# Altium schematic sheet RF.SchDoc: Kite Up
size A; Author: PIF.HW Team; CompanyName: Pay It Forward club; DrawnBy: PIF.HW Team; Organization: Pay It Forward club; Address1: 304B1, HCMC; Address2: 268 Ly Thuong Kiet street; Address3: Ward 14, District 10; Address4: Ho Chi Minh city, Vietnam; Revision: v1.3; SheetNumber: 2; SheetTotal: 2; ProjectTitle: Kite Up; DocumentName: Kite Up RC; ProjectName: Kite Up
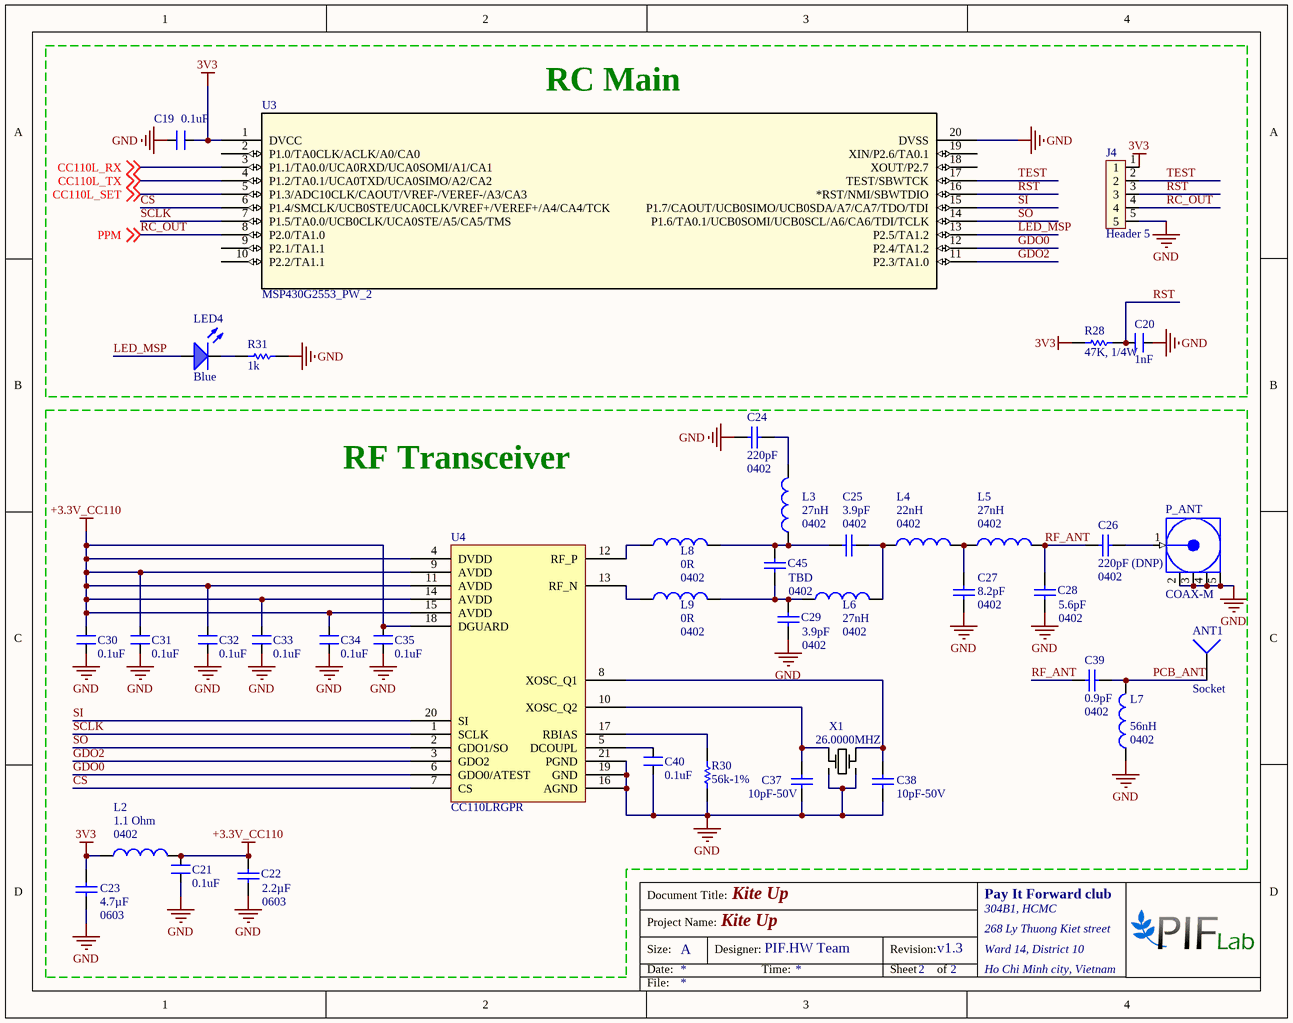
[diagram p0: RF.SchDoc]

## Parts
ANT1  Socket  [433_Antenna]
C19  0.1uF  [CAP 0603(1508)]
C20  1nF  [CAP 0603(1508)]
C21  0.1uF  [CAP 0603(1508)]
C22  Capacitance: 2.2µF  Package / Case: 0603  [CAP 0603(1508)]  (hidden comment: 2.2UF 10V X5R 0603)
C23  Capacitance: 4.7µF  Package / Case: 0603  [CAP 0603(1508)]  (hidden comment: 4.7UF 10V X5R 0603)
C24  Capacitance: 220pF  Package / Case: 0402  [C0402_TYPE2]
C25  Capacitance: 3.9pF  Package / Case: 0402  [C0402_TYPE2]
C26  Capacitance: 220pF (DNP)  Package / Case: 0402  [C0402_TYPE2]
C27  Capacitance: 8.2pF  Package / Case: 0402  [C0402_TYPE2]
C28  Capacitance: 5.6pF  Package / Case: 0402  [C0402_TYPE2]
C29  Capacitance: 3.9pF  Package / Case: 0402  [C0402_TYPE2]
C30  0.1uF  [CAP 0603(1508)]
C31  0.1uF  [CAP 0603(1508)]
C32  0.1uF  [CAP 0603(1508)]
C33  0.1uF  [CAP 0603(1508)]
C34  0.1uF  [CAP 0603(1508)]
C35  0.1uF  [CAP 0603(1508)]
C37  10pF-50V  [C0402_TYPE2]
C38  10pF-50V  [C0402_TYPE2]
C39  Capacitance: 0.9pF  Package / Case: 0402  [C0402_TYPE2]
C40  0.1uF  [CAP 0603(1508)]
C45  Capacitance: TBD  Package / Case: 0402  [C0402_TYPE2]  (no BOM)
J4  Header 5  [Header 5]
L2  DC Resistance (DCR) (Max): 1.1 Ohm  Package / Case: 0402  [L0402_TYPE2]
L3  Inductance: 27nH  Package / Case: 0402  [L0402_TYPE2]
L4  Inductance: 22nH  Package / Case: 0402  [L0402_TYPE2]
L5  Inductance: 27nH  Package / Case: 0402  [L0402_TYPE2]
L6  Inductance: 27nH  Package / Case: 0402  [L0402_TYPE2]
L7  Inductance: 56nH  Package / Case: 0402  [L0402_TYPE2]
L8  Inductance: 0R  Package / Case: 0402  [L0402_TYPE2]
L9  Inductance: 0R  Package / Case: 0402  [L0402_TYPE2]
LED4  value Blue  [LED0805BLUE]  (hidden comment: LED_BLUE)
P_ANT  COAX-M  [MMCX2.54-V5]
R28  47K, 1/4W  [RES 0603(1508)]
R30  56k-1%  [R0402_TYPE2]
R31  1k  [RES 0603(1508)]
U3  MSP430G2553_PW_2  [PW20]
U4  CC110LRGPR  [VQFN20]
X1  26.0000MHZ  [Crystal-3.2x2.5]

## Blocks framed on the sheet
RC Main: C19 C20 J4 LED4 R28 R31 U3
RF Transceiver: ANT1 C21-C35 C37-C40 C45 L2-L9 P_ANT R30 U4 X1

## Nets
3V3: C19.1 C23.2 J4.1 L2.2 R28.1 U3.1(DVCC)
+3.3V_CC110: C21.2 C22.2 C30.2 C31.2 C32.2 C33.2 C34.2 C35.2 L2.1 U4.4(DVDD) U4.9(AVDD) U4.11(AVDD) U4.14(AVDD) U4.15(AVDD) U4.18(DGUARD)
GND: C19.2 C20.2 C21.1 C22.1 C23.1 C24.1 C27.1 C28.1 C29.2 C30.1 C31.1 C32.1 C33.1 C34.1 C35.1 C37.1 C38.1 C40.1 J4.5 L7.2 P_ANT.2(GND) P_ANT.3(GND) P_ANT.4(GND) P_ANT.5(GND) R30.1 R31.1 U3.20(DVSS) U4.16(AGND) U4.19(GND) U4.21(PGND) X1.2(GND) X1.4(GND)
CC110L_RX: U3.3(P1.1/TA0.0/UCA0RXD/UCA0SOMI/A1/CA1) ; off-sheet CC110L_RX
CC110L_SET: U3.5(P1.3/ADC10CLK/CAOUT/VREF-/VEREF-/A3/CA3) ; off-sheet CC110L_SET
CC110L_TX: U3.4(P1.2/TA0.1/UCA0TXD/UCA0SIMO/A2/CA2) ; off-sheet CC110L_TX
CS: U3.6(P1.4/SMCLK/UCB0STE/UCA0CLK/VREF+/VEREF+/A4/CA4/TCK) U4.7(CS)
GDO0: U3.12(P2.4/TA1.2) U4.6(GDO0/ATEST)
GDO2: U3.11(P2.3/TA1.0) U4.3(GDO2)
LED_MSP: LED4.1(A) U3.13(P2.5/TA1.2)
PCB_ANT: ANT1.1 C39.2 L7.1
RC_OUT: J4.4 U3.8(P2.0/TA1.0) ; off-sheet PPM  [also labelled PPM]
RF_ANT: C26.1 C28.2 C39.1 L5.1
RST: C20.1 J4.3 R28.2 U3.16(*RST/NMI/SBWTDIO)
SCLK: U3.7(P1.5/TA0.0/UCB0CLK/UCA0STE/A5/CA5/TMS) U4.1(SCLK)
SI: U3.15(P1.7/CAOUT/UCB0SIMO/UCB0SDA/A7/CA7/TDO/TDI) U4.20(SI)
SO: U3.14(P1.6/TA0.1/UCB0SOMI/UCB0SCL/A6/CA6/TDI/TCLK) U4.2(GDO1/SO)
TEST: J4.2 U3.17(TEST/SBWTCK)
NetC24_2: C24.2 L3.1
NetC25_1: C25.1 C45.1 L3.2 L8.1
NetC25_2: C25.2 L4.2 L6.1
NetC26_2: C26.2 P_ANT.1(Signal)
NetC27_2: C27.2 L4.1 L5.2
NetC29_1: C29.1 C45.2 L6.2 L9.1
NetC37_2: C37.2 U4.10(XOSC_Q2) X1.1(HOT)
NetC38_2: C38.2 U4.8(XOSC_Q1) X1.3(HOT)
NetC40_2: C40.2 U4.5(DCOUPL)
NetL8_2: L8.2 U4.12(RF_P)
NetL9_2: L9.2 U4.13(RF_N)
NetLED4_2: LED4.2(K) R31.2
NetR30_2: R30.2 U4.17(RBIAS)

Not connected (* = marked no-connect by the designer): U3 2(P1.0/TA0CLK/ACLK/A0/CA0) 9(P2.1/TA1.1) 10(P2.2/TA1.1) 18(XOUT/P2.7) 19(XIN/P2.6/TA0.1)

## Notes on the sheet
- Document Title:
- Size:
- Date:
- Project Name:
- A
- Designer:
- Time:
- Revision:
- Sheet
- of
- File:

## Library data of the parts
C19-C21 C30-C35 C40 = CAP_NONPOL: Ceramic capacitor
C22 = 100nF-16V-C0402: CAP CER 2.2UF 10V X5R 0603; Manufacturer: Yageo; Manufacturer Part Number: CC0603KRX5R6BB225; Tolerance: ±10%; Supplier 1: Digi-Key; Supplier Part Number 1: 311-1451-2-ND; RoHS: RoHS Compliant; Category: Capacitors; Stock 1: 360000; Pricing 1: 4000=0.01939, 8000=0.01804, 12000=0.01714, 28000=0.01624, 100000=0.01229 (USD); Packaging: Tape & Reel (TR); Voltage - Rated: 10V; Temperature Coefficient: X5R; Mounting Type: Surface Mount, MLCC; Operating Temperature: -55°C ~ 85°C; Applications: General Purpose; Ratings: -; Size / Dimension: 0.063" L x 0.031" W (1.60mm x 0.80mm); Height - Seated (Max): -; Thickness (Max): 0.035" (0.90mm); Lead Spacing: -; Features: -; Lead Style: -; ComponentLink1URL: http://www.yageo.com/documents/recent/UPY-GPHC_X5R_4V-to-50V-21.pdf; ComponentLink1Description: http://www.yageo.com/documents/recent/UPY-GPHC_X5R_4V-to-50V-21.pdf
C23 = 10pF-50V-C0402-5%: CAP CER 4.7UF 10V X5R 0603; Manufacturer: Yageo; Manufacturer Part Number: CC0603KRX5R6BB475; Tolerance: ±10%; Supplier 1: Digi-Key; Supplier Part Number 1: 311-1455-1-ND; RoHS: RoHS Compliant; Category: Capacitors; Stock 1: 521169; Pricing 1: 1=0.15, 10=0.1, 25=0.0752, 100=0.0476, 250=0.04008, 500=0.03356, 1000=0.02755 (USD); Packaging: Cut Tape (CT); Voltage - Rated: 10V; Temperature Coefficient: X5R; Mounting Type: Surface Mount, MLCC; Operating Temperature: -55°C ~ 85°C; Applications: General Purpose; Ratings: -; Size / Dimension: 0.063" L x 0.031" W (1.60mm x 0.80mm); Height - Seated (Max): -; Thickness (Max): 0.035" (0.90mm); Lead Spacing: -; Features: -; Lead Style: -; ComponentLink1URL: http://www.yageo.com/documents/recent/UPY-GPHC_X5R_4V-to-50V-21.pdf; ComponentLink1Description: http://www.yageo.com/documents/recent/UPY-GPHC_X5R_4V-to-50V-21.pdf
C24 C26 C39 = 3.3pF-50V-C0402-0.25pF: CAP CER 3.9PF 50V NP0 0402; Manufacturer: Murata Electronics North America; Manufacturer Part Number: GRM1555C1H221JA01D; Tolerance: ±5%; Temperature Coefficient: C0G, NP0; Supplier 1: Digi-Key; Supplier Part Number 1: 490-1293-2-ND; RoHS: RoHS Compliant; Category: Capacitors; Stock 1: 470000; Pricing 1: 10000=0.00336, 20000=0.0032, 30000=0.00304, 50000=0.00272, 100000=0.0022 (USD); Packaging: Tape & Reel (TR); Voltage - Rated: 50V; Mounting Type: Surface Mount, MLCC; Operating Temperature: -55°C ~ 125°C; Applications: General Purpose; Ratings: -; Size / Dimension: 0.039" L x 0.020" W (1.00mm x 0.50mm); Height - Seated (Max): -; Thickness (Max): 0.022" (0.55mm); Lead Spacing: -; Features: -; Lead Style: -; ComponentLink1URL: http://www.murata.com/~/media/webrenewal/support/library/catalog/products/capacitor/mlcc/c02e.pdf; ComponentLink1Description: http://www.murata.com/~/media/webrenewal/support/library/catalog/products/capacitor/mlcc/c02e.pdf
C25 C29 C45 = 3.3pF-50V-C0402-0.25pF: CAP CER 3.9PF 50V NP0 0402; Manufacturer: Murata Electronics North America; Manufacturer Part Number: GRM1555C1H3R9CZ01D; Tolerance: ±0.25pF; Temperature Coefficient: C0G, NP0; Supplier 1: Digi-Key; Supplier Part Number 1: 490-1272-2-ND; RoHS: RoHS Compliant; Category: Capacitors; Stock 1: 0; Pricing 1: 10000=0 (USD); Packaging: Tape & Reel (TR); Voltage - Rated: 50V; Mounting Type: Surface Mount, MLCC; Operating Temperature: -55°C ~ 125°C; Applications: General Purpose; Ratings: -; Size / Dimension: 0.039" L x 0.020" W (1.00mm x 0.50mm); Height - Seated (Max): -; Thickness (Max): 0.022" (0.55mm); Lead Spacing: -; Features: -; Lead Style: -; ComponentLink1URL: http://media.digikey.com/pdf/Data%20Sheets/Murata%20PDFs/Chip%20Monolithic%20Ceramic%20Caps.pdf; ComponentLink1Description: http://media.digikey.com/pdf/Data%20Sheets/Murata%20PDFs/Chip%20Monolithic%20Ceramic%20Caps.pdf
C27 = 8.2pF-50V-C0402-0.5pF: GRM1555C1H8R2CZ01D; Manufacturer: Murata Electronics North America; Tolerance: ±0.25pF; Voltage - Rated: 50V; Temperature Coefficient: C0G, NP0; Supplier 1: Digi-Key; Supplier Part Number 1: GRM1555C1H8R2CZ01D-ND; Manufacturer Part Number: GRM1555C1H8R2CZ01D; RoHS: RoHS Compliant; Category: Capacitors; Stock 1: 0; Pricing 1: 60000=0 (USD); Packaging: Tape & Reel (TR); Mounting Type: Surface Mount, MLCC; Operating Temperature: -55°C ~ 125°C; Applications: General Purpose; Ratings: -; Size / Dimension: 0.039" L x 0.020" W (1.00mm x 0.50mm); Height - Seated (Max): -; Thickness (Max): 0.022" (0.55mm); Lead Spacing: -; Features: -; Lead Style: -; ComponentLink1URL: http://media.digikey.com/pdf/Data%20Sheets/Murata%20PDFs/Chip%20Monolithic%20Ceramic%20Caps.pdf; ComponentLink1Description: http://media.digikey.com/pdf/Data%20Sheets/Murata%20PDFs/Chip%20Monolithic%20Ceramic%20Caps.pdf
C28 = 5.6pF-50V-C0402-0.5pF: CAP CER 5.6PF 50V NP0 0402; Manufacturer: Murata Electronics North America; Manufacturer Part Number: GRM1555C1H5R6CZ01D; Tolerance: ±0.25pF; Temperature Coefficient: C0G, NP0; Supplier 1: Digi-Key; Supplier Part Number 1: GRM1555C1H5R6CZ01D-ND; RoHS: RoHS Compliant; Category: Capacitors; Stock 1: 0; Pricing 1: 60000=0 (USD); Packaging: Tape & Reel (TR); Voltage - Rated: 50V; Mounting Type: Surface Mount, MLCC; Operating Temperature: -55°C ~ 125°C; Applications: General Purpose; Ratings: -; Size / Dimension: 0.039" L x 0.020" W (1.00mm x 0.50mm); Height - Seated (Max): -; Thickness (Max): 0.022" (0.55mm); Lead Spacing: -; Features: -; Lead Style: -; ComponentLink1URL: http://media.digikey.com/pdf/Data%20Sheets/Murata%20PDFs/Chip%20Monolithic%20Ceramic%20Caps.pdf; ComponentLink1Description: http://media.digikey.com/pdf/Data%20Sheets/Murata%20PDFs/Chip%20Monolithic%20Ceramic%20Caps.pdf
C37 C38 = 10pF-50V-C0402-5%: CAP CER 10PF 50V NPO 0402; Manufacturer: Yageo; Manufacturer Part Number: CC0402JRNPO9BN100; Digi-Key Part Number: 311-1014-1-ND; Unit Price: 0.00312
L2 = 8.2nH-500mA-0402: FERRITE BEAD 1 KOHM 0402 1LN; Manufacturer: Murata Electronics North America; Manufacturer Part Number: BLM15HG102SN1D; Filter Type: Signal Line; Number of Lines: 1; Impedance @ Frequency: 1 kOhm @ 100MHz; Current Rating (Max): 250mA; Supplier 1: Digi-Key; Supplier Part Number 1: 490-3999-2-ND; RoHS: RoHS Compliant; Category: Filters; Stock 1: 230000; Pricing 1: 10000=0.0509, 20000=0.04844, 30000=0.04713 (USD); Packaging: Tape & Reel (TR); Ratings: -; Operating Temperature: -55°C ~ 125°C; Mounting Type: Surface Mount; Height (Max): 0.022" (0.55mm); Size / Dimension: 0.039" L x 0.020" W (1.00mm x 0.50mm); ComponentLink1URL: http://search.murata.co.jp/Ceramy/image/img/PDF/ENG/L0110S0101BLM15H.pdf; ComponentLink1Description: http://search.murata.co.jp/Ceramy/image/img/PDF/ENG/L0110S0101BLM15H.pdf
L3 L5-L9 = 8.2nH-500mA-0402: FIXED IND 27NH 300MA 460 MOHM; Manufacturer: Murata Electronics North America; Manufacturer Part Number: LQG15HS27NJ02D; Type: Multilayer; Material - Core: Air; Tolerance: ±5%; Shielding: Unshielded; DC Resistance (DCR): 460 mOhm Max; Q @ Freq: 8 @ 100MHz; Frequency - Self Resonant: 1.7GHz; Frequency - Test: 100MHz; Supplier 1: Digi-Key; Supplier Part Number 1: 490-2628-2-ND; RoHS: RoHS Compliant; Category: Inductors, Coils, Chokes; Stock 1: 120000; Pricing 1: 10000=0.01872, 30000=0.01814, 50000=0.01755, 100000=0.01697 (USD); Packaging: Tape & Reel (TR); Current Rating: 300mA; Current - Saturation: -; Ratings: -; Operating Temperature: -55°C ~ 125°C; Mounting Type: Surface Mount; Size / Dimension: 0.039" L x 0.020" W (1.00mm x 0.50mm); Height - Seated (Max): 0.022" (0.55mm); ComponentLink1URL: http://search.murata.co.jp/Ceramy/image/img/PDF/ENG/L0075S0083LQG15HS.pdf; ComponentLink1Description: http://search.murata.co.jp/Ceramy/image/img/PDF/ENG/L0075S0083LQG15HS.pdf
L4 = 8.2nH-500mA-0402: FIXED IND 22NH 300MA 420 MOHM; Manufacturer: Murata Electronics North America; Manufacturer Part Number: LQG15HS22NJ02D; Type: Multilayer; Material - Core: Air; Tolerance: ±5%; Shielding: Unshielded; DC Resistance (DCR): 420 mOhm Max; Q @ Freq: 8 @ 100MHz; Frequency - Self Resonant: 1.9GHz; Frequency - Test: 100MHz; Supplier 1: Digi-Key; Supplier Part Number 1: 490-2627-1-ND; RoHS: RoHS Compliant; Category: Inductors, Coils, Chokes; Stock 1: 250711; Pricing 1: 1=0.1, 10=0.059, 25=0.0528, 50=0.0456, 100=0.041, 250=0.03804, 500=0.0351, 750=0.03335, 1000=0.03042 (USD); Packaging: Cut Tape (CT); Current Rating: 300mA; Current - Saturation: -; Ratings: -; Operating Temperature: -55°C ~ 125°C; Mounting Type: Surface Mount; Size / Dimension: 0.039" L x 0.020" W (1.00mm x 0.50mm); Height - Seated (Max): 0.022" (0.55mm); ComponentLink1URL: http://search.murata.co.jp/Ceramy/image/img/PDF/ENG/L0075S0083LQG15HS.pdf; ComponentLink1Description: http://search.murata.co.jp/Ceramy/image/img/PDF/ENG/L0075S0083LQG15HS.pdf
LED4 = LED_BLUE: LED Blue; ComponentLink1Description: Datasheet; ComponentLink1URL: D:\Dropbox\Datasheets\Opto and Illumination\LEDs\SMD LED.pdf; Unit Price: 0.0476
P_ANT = COAX-M: RF Coaxial PCB Connector, MMCX; Thru-Hole, Vertical Mount Plug,  50 Ohm Impedance; PackageDocument: Rev. A, 16-Jun-1997; PCB_Layout: Complies with manufacturer's recommendation.; DrillSize: Corresponds to nominal value.; Published: 15-Jul-2004; LatestRevisionDate: 15-Jul-2004; LatestRevisionNote: Component Replaced.; DatasheetDocument: 30-May-2003; PackageReference: 908-21103; Publisher: Altium Limited; ComponentLink1Description: Manufacturer Link; ComponentLink1URL: http://www.amphenolrf.com/
R28 R31 = Res 1/4W: Resistor through hole 1/4W
R30 = 56k-1%-R0402: RES 56.0K OHM 1/16W 1% 0402 SMD; Manufacturer: Yageo; Manufacturer Part Number: RC0402FR-0756KL; Digi-Key Part Number: 311-56.0KLRTR-ND; Unit Price: 0.00149
U3 = MSP430G2553_PW_2: Imported; Manufacturer_Part_Number: msp430g2553_pw_20; Vendor: Texas Instruments; PACKAGE_DESIGNATOR: PW; PIN_COUNT: 20; FAMILY_NAME: Value Line; INDUSTRY_STD_PKG_TYPE: TSSOP; GENERIC_PART_NUMBER: MSP430G2553; Manufacturer: Texas Instruments; Datasheet_URL: http://www.ti.com/lit/gpn/MSP430G2553; Value: Value; Type: Type; RefDes: RefDes
U4 = CC110LRGPR: IC RF TXRX ISM<1GHZ 20-VFQFN; Manufacturer: Texas Instruments; RF Family/Standard: General ISM < 1GHz; Modulation: 2FSK, 4FSK, GFSK, MSK, OOK; Frequency: 300MHz ~ 348MHz, 387MHz ~ 464MHz, 779MHz ~ 928MHz; Data Rate (Max): 600kbps; Power - Output: 12dBm; Sensitivity: -116dBm; Serial Interfaces: SPI; Voltage - Supply: 1.8 V ~ 3.6 V; Current - Receiving: 14.3mA ~ 17.1mA; Current - Transmitting: 12.3mA ~ 34.2mA; Supplier 1: Digi-Key; RoHS: RoHS Compliant; Category: RF/IF and RFID; Stock 1: 0; Pricing 1: 3000=1.9285, 6000=1.84875, 15000=1.8125 (USD); Packaging: Tape & Reel (TR); Type: TxRx Only; Protocol: -; Memory Size: -; GPIO: -; Operating Temperature: -40°C ~ 85°C; Package / Case: 20-VFQFN Exposed Pad; ComponentLink1URL: http://www.ti.com/lit/ds/symlink/cc110l.pdf; ComponentLink1Description: http://www.ti.com/lit/ds/symlink/cc110l.pdf; Supplier Part Number 1: 296-35719-2-ND; Manufacturer Part Number: CC110LRGPR
X1 = CX3225SB26000D0FFFCC: CRYSTAL 26.0000MHZ 8PF SMD; Manufacturer: AVX Corp/Kyocera Corp; Frequency: 26MHz; Frequency Stability: ±15ppm; Frequency Tolerance: ±10ppm; ESR (Equivalent Series Resistance): 50 Ohm; Operating Mode: Fundamental; Supplier 1: Digi-Key; RoHS: RoHS Compliant; Category: Crystals and Oscillators; Stock 1: 3000; Pricing 1: 3000=0.406, 6000=0.392, 15000=0.378 (USD); Packaging: Tape & Reel (TR); Type: MHz Crystal; Load Capacitance: 8pF; Operating Temperature: -20°C ~ 70°C; Ratings: -; Mounting Type: Surface Mount; Package / Case: 4-SMD, No Lead (DFN, LCC); Size / Dimension: 0.126" L x 0.098" W (3.20mm x 2.50mm); Height: 0.024" (0.60mm); ComponentLink1URL: http://media.digikey.com/pdf/Data%20Sheets/Optrex%20PDFs/CX3225SByyy00D0FFFCC_Spec.pdf; ComponentLink1Description: http://media.digikey.com/pdf/Data%20Sheets/Optrex%20PDFs/CX3225SByyy00D0FFFCC_Spec.pdf; Supplier Part Number 1: 1253-1354-2-ND; Manufacturer Part Number: CX3225SB26000D0FFFCC
ANT1 = Socket: LatestRevisionDate: 17-Jul-2002; LatestRevisionNote: Re-released for DXP Platform.; Publisher: Altium Limited